# EAGLE design MainBoard (EAGLE 9.5.1)

## Sheet 1 of 5
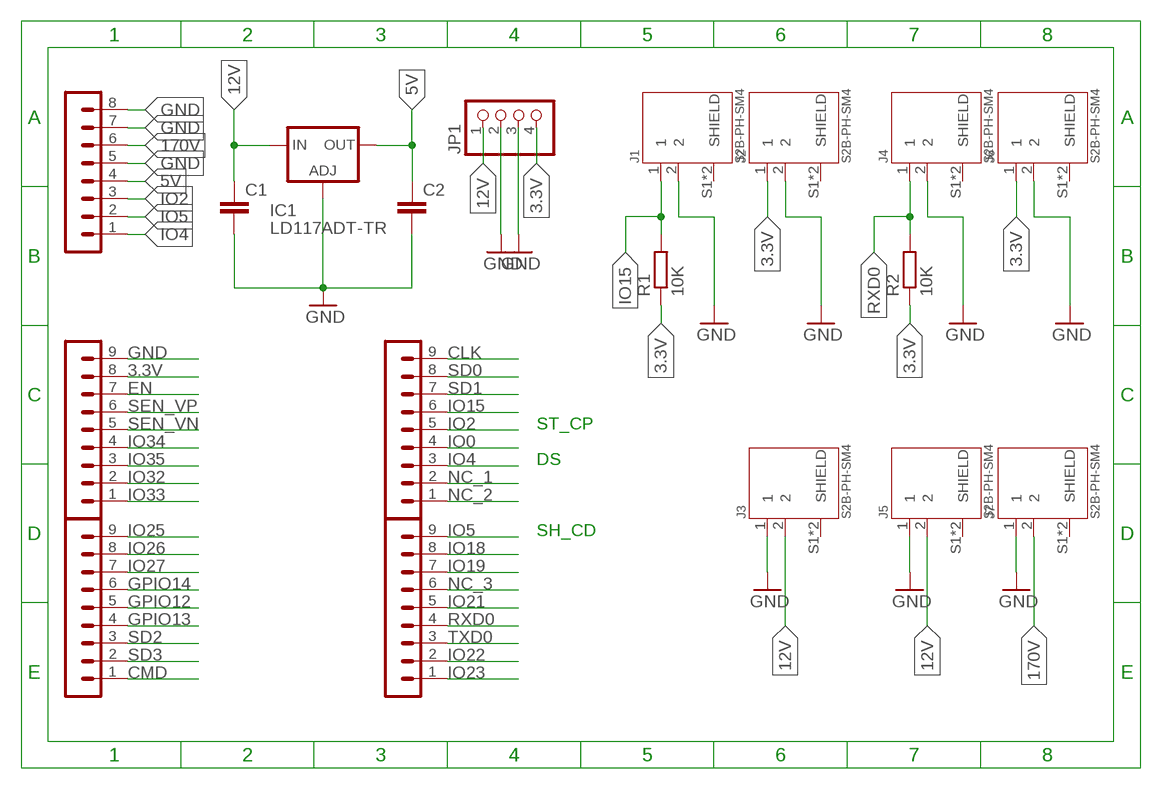
[diagram p0: schematic, sheet 1]

### Parts
C1  C-EU_1206C1206  [C1206]
C2  C-EU_1206C1206  [C1206]
IC1  LD117ADT-TR  [DPACK]
J1  S2B-PH-SM4  [JST_S2B-PH-SM4-TB(LF)(SN)]
J2  S2B-PH-SM4  [JST_S2B-PH-SM4-TB(LF)(SN)]
J3  S2B-PH-SM4  [JST_S2B-PH-SM4-TB(LF)(SN)]
J4  S2B-PH-SM4  [JST_S2B-PH-SM4-TB(LF)(SN)]
J5  S2B-PH-SM4  [JST_S2B-PH-SM4-TB(LF)(SN)]
J6  S2B-PH-SM4  [JST_S2B-PH-SM4-TB(LF)(SN)]
J7  S2B-PH-SM4  [JST_S2B-PH-SM4-TB(LF)(SN)]
JP1  PINHD-1X4  [1X04]
R1  10K  R-EU_1206R1206  [R1206]
R2  10K  R-EU_1206R1206  [R1206]
SV1  PINHEADER-1X8  [MA08-1]
SV2  PINHEADER-1X9  [MA09-1]
SV3  PINHEADER-1X9  [MA09-1]
SV4  PINHEADER-1X9  [MA09-1]
SV5  PINHEADER-1X9  [MA09-1]

### Nets
3.3V: J2.1 J6.1 JP1.4 R1.1 R2.1 SV2.8
5V: C2.1 IC1.4(OUT) SV1.4
12V: C1.1 IC1.3(IN) J3.2 J5.2 JP1.1
170V: J7.2 SV1.6
CLK: SV4.9
CMD: SV3.1
EN [other]: SV2.7
GND: C1.2 C2.2 IC1.1(ADJ) J1.2 J2.2 J3.1 J4.2 J5.1 J6.2 J7.1 JP1.2 JP1.3 SV1.5 SV1.7 SV1.8 SV2.9
GPIO12: SV3.5
GPIO13: SV3.4
GPIO14: SV3.6
IO0 [other]: SV4.4
IO2: SV1.3 SV4.5
IO4: SV1.1 SV4.3
IO5: SV1.2 SV5.9
IO15: J1.1 R1.2 SV4.6
IO18: SV5.8
IO19: SV5.7
IO21: SV5.5
IO22: SV5.2
IO23: SV5.1
IO25: SV3.9
IO26: SV3.8
IO27: SV3.7
IO32: SV2.2
IO33: SV2.1
IO34: SV2.4
IO35: SV2.3
NC_1: SV4.2
NC_2: SV4.1
NC_3: SV5.6
RXD0 [other]: J4.1 R2.2 SV5.4
SD0: SV4.8
SD1: SV4.7
SD2: SV3.3
SD3: SV3.2
SEN_VN: SV2.5
SEN_VP: SV2.6
TXD0 [other]: SV5.3
Unconnected: J1.S1(SHIELD) J1.S2(SHIELD) J2.S1(SHIELD) J2.S2(SHIELD) J3.S1(SHIELD) J3.S2(SHIELD) J4.S1(SHIELD) J4.S2(SHIELD) J5.S1(SHIELD) J5.S2(SHIELD) J6.S1(SHIELD) J6.S2(SHIELD) J7.S1(SHIELD) J7.S2(SHIELD)

### Notes on the sheet
- ST_CP
- DS
- SH_CD

## Sheet 2 of 5
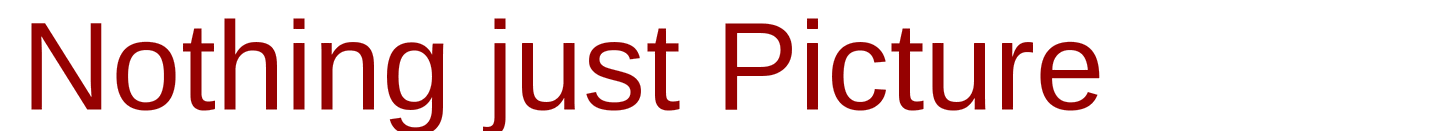
[diagram p1: schematic, sheet 2]

### Notes on the sheet
- Nothing just Picture

## Sheet 3 of 5

## Sheet 4 of 5
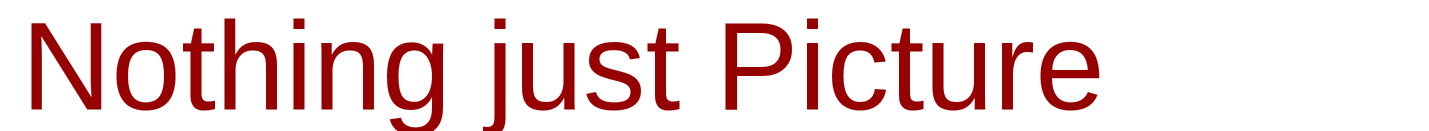
[diagram p2: schematic, sheet 4]

### Notes on the sheet
- Nothing just Picture

## Sheet 5 of 5

## Library data of the parts
C1 C2 = CommonParts:C-EU_1206: CAPACITOR, European symbol; SPICEPREFIX: C
IC1 = nixie_tube:LD117A?*: Low drop fixed and adjustable positive voltage regulators 1 A Source: http://www.st.com/stonline/products/literature/ds/7194/ld1117axx.pdf
J1-J7 = CommonParts:S2B-PH-SM4: PH Series 2 Position 2 mm Pitch Surface Mount Side Entry Shrouded Header; DESCRIPTION: PH Series 2 Position 2 mm Pitch Surface Mount Side Entry Shrouded Header; DIGI-KEY_PART_NUMBER: 455-1749-1-ND; DIGI-KEY_PURCHASE_URL: https://www.digikey.com/product-detail/en/jst-sales-america-inc/S2B-PH-SM4-TB_LF__SN_/455-1749-1-ND/926846?utm_source=snapeda&utm_medium=aggregator&utm_campaign=symbol; MF: JST Sales; MP: S2B-PH-SM4-TB_LF__SN_; PACKAGE: None
JP1 = pinhead:PINHD-1X4: PIN HEADER
R1 R2 = CommonParts:R-EU_1206: RESISTOR, European symbol
SV1 = CommonParts:PINHEADER-1X8: PIN HEADER; OC_FARNELL: unknown; OC_NEWARK: unknown
SV2-SV5 = CommonParts:PINHEADER-1X9: PIN HEADER; OC_FARNELL: unknown; OC_NEWARK: unknown

## Net classes
0 default: width 0.2 mm, drill 0.6 mm, clearance 0.2 mm
1 other: width 0.2 mm, drill 0.2 mm, clearance 0.1 mm

## Board
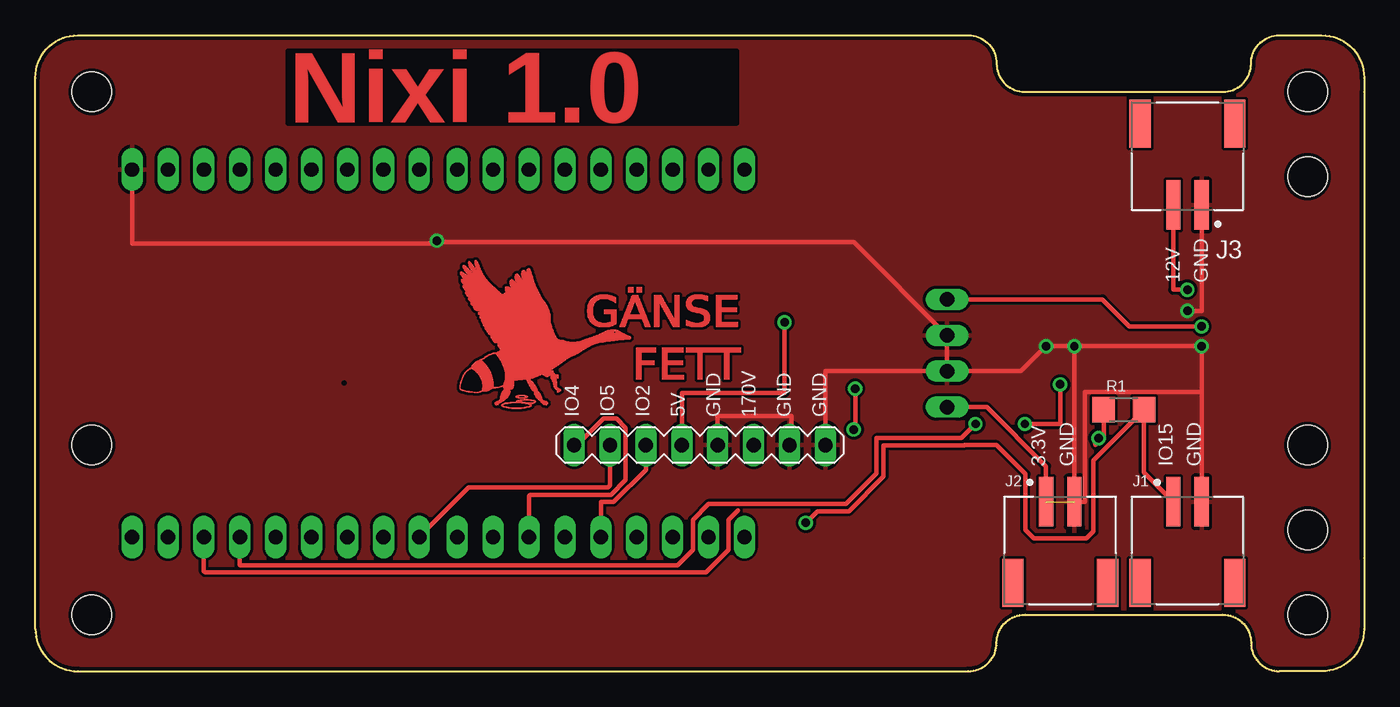
[diagram p3: board, top side]
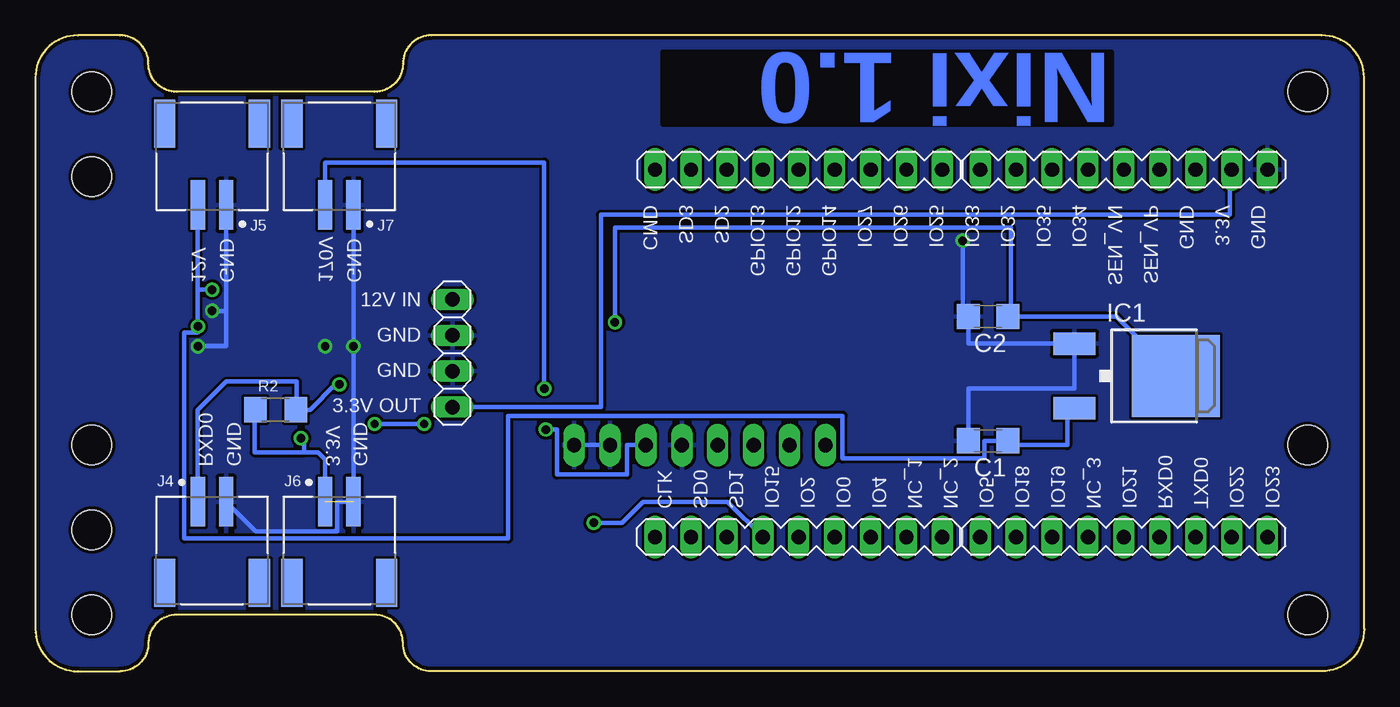
[diagram p4: board, bottom side, seen from below]

Size 94 x 45 mm. Coordinates in mm from the lower left corner, seen from the top.
Outline: 94,41 94,42 arc90 91,45 88,45 arc90 86,43 arc-90 84,41 70,41 arc-90 68,43 arc90 66,45 3,45 arc90 0,42 0,3 arc90 3,0 66,0 arc90 68,2 arc-90 70,4 84,4 arc-90 86,2 arc90 88,0 91,0 arc90 94,3 94,41
Outline: 94,41 94,8
Copper layers (1*16): Top 0.035mm / dielectric 1.5mm / Bottom 0.035mm
Design rules "Main_1": minimum track width 6mil, minimum drill 0.35mm, track to track 6mil, track to pad 6mil, pad to pad 6mil, via to via 6mil, smd to smd 6mil, copper to edge 10mil, drill to drill 6mil, minimum pad ring 10mil, minimum via ring 8mil, stop-mask expansion 4mil, vias tented up to drill 0mil, thermal gap 10mil
Holes 2.8 mm at 4,16 4,41 90,41 90,16 90,35 4,4 90,10 90,4
tKeepout: area 33.7,18.6 to 34.4,18.6; area 33.4,18.6 to 34.6,18.6; area 33.3,18.6 to 34.8,18.7; area 33.2,18.7 to 33.8,18.7; area 34.3,18.7 to 34.9,18.7; area 33.1,18.7 to 33.5,18.7; area 34.6,18.7 to 35,18.7; area 33.1,18.7 to 33.4,18.7; area 34.7,18.7 to 35,18.7; area 33,18.7 to 33.2,18.8; area 34.8,18.7 to 35.1,18.8; area 33,18.8 to 33.2,18.8; 2068 more areas

### Footprints (pad centres in the part's own frame; a part is rotated, then mirrored left to right if it is on the bottom)
C1206 = smd 1.6 x 1.8: 1 -1.4,0; 2 1.4,0
DPACK = smd 1.6 x 3: 1 -2.28,-4.8; 3 2.28,-4.8 | smd 5.8 x 6.2: 4 0,2.38
JST_S2B-PH-SM4-TB(LF)(SN) = smd 1 x 3.5: 1 -1,0; 2 1,0 | smd 1.5 x 3.4: S1 -3.35,-5.75; S2 3.35,-5.75
1X04 = drill 1.016 long: 1 -3.81,0; 2 -1.27,0; 3 1.27,0; 4 3.81,0
R1206 = smd 1.6 x 1.803: 1 -1.422,0; 2 1.422,0
MA08-1 = drill 1.016 long: 1 -8.89,0; 2 -6.35,0; 3 -3.81,0; 4 -1.27,0; 5 1.27,0; 6 3.81,0; 7 6.35,0; 8 8.89,0
MA09-1 = drill 1.016 long: 1 -10.16,0; 2 -7.62,0; 3 -5.08,0; 4 -2.54,0; 5 0,0; 6 2.54,0; 7 5.08,0; 8 7.62,0; 9 10.16,0

### Placement (x,y rotation side)
C1  26.6,16.3 180 bottom
C2  26.6,25.1 180 bottom
IC1  15.7,20.9 270 bottom
J1  81.5,12 0 top
J2  72.5,12 0 top
J3  81.5,33 180 top
J4  81.5,12 0 bottom
J5  81.5,33 180 bottom
J6  72.5,12 0 bottom
J7  72.5,33 180 bottom
JP1  64.5,22.5 270 bottom
R1  77,18.5 0 top
R2  77,18.5 0 bottom
SV1  47,16 0 top
SV2  17,35.5 0 bottom
SV3  40,35.5 0 bottom
SV4  40,9.5 180 bottom
SV5  17,9.5 180 bottom

### Tracks (layer width: path | path; a pad name or v marks a point on that pad's centre or on a via)
3.3V  (via drill 0.6)  (1 unrouted)
  Top 0.305: J2.1 71.5,14.5 67.31,18.69 JP1.4 | R1.1 75.58,16.58 75,16 75,16.29 v75.21,16.5
  Bottom 0.305: 75,15.5 74,15.5 73.5,15 J6.1 73.5,11.5 | 75,15.5 78.5,15.5 78.5,18.42 R2.1 | v75.21,16.5 75,16.29 75,15.5 | JP1.4 54,18.69 54,32.3 9.5,32.3 9.5,35.38 SV2.8
5V  (via drill 0.6)
  Top 0.305: SV1.4 45.73,19.7 53,19.7 v53,24.7
  Bottom 0.305: IC1.4 17.52,25.1 25,25.1 | 25,25.1 C2.1 | v53,24.7 53,31.4 25,31.4 25,25.1
12V  (via drill 0.6)
  Top 0.305: JP1.1 75.49,26.31 77.4,24.4 v82.5,24.4 | J3.2 80.5,27 v81.5,27
  Bottom 0.305: IC1.3 21,18.62 21,16 25.2,16 C1.1 26.85,16.3 26.85,15.05 36.89,15.05 36.89,18.08 60.54,18.08 60.54,9.39 83.46,9.39 83.46,23.96 82.5,23.96 v82.5,24.4 82.5,27 | 82.5,27 J5.2 | v81.5,27 82.5,27
170V  (via drill 0.6)
  Top 0.305: v57.9,17.11 58,17.11 v58,20
  Bottom 0.305: SV1.6 52.13,16 52.13,13.92 57.11,13.92 57.11,17.11 v57.9,17.11 | J7.2 73.5,36 58,36 v58,20
GND  (via drill 0.6)
  Top 0.305: JP1.3 69.73,21.23 v71.5,23 v73.5,23 | SV1.8 55.89,21.23 JP1.3 | SV2.9 6.84,30.27 28.4,30.27 v28.4,30.47 28.5,30.37 57.9,30.37 JP1.2 JP1.3 | J1.2 82.5,19.75 | 82.5,19.75 v82.5,23 v73.5,23 | v73.5,23 J2.2 74.25,12 74.25,19.75 82.5,19.75 | SV1.5 48.27,18.08 53.5,18.08 53.5,16 SV1.7 | J3.1 82.5,25.5 v81.5,25.5
  Bottom 0.305: C1.2 28,20 20.5,20 IC1.1 28,23.18 C2.2 28.4,25.5 v28.4,30.47 | SV1.8 SV1.7 | J4.2 78.4,9.9 72.65,9.9 72.65,12 J6.2 v71.5,23 J7.1 | J5.1 80.5,25.5 | 80.5,25.5 80.5,23 v82.5,23 | v81.5,25.5 80.5,25.5
  pour Top: 0,46 94,46 94,0 0,0
  pour Bottom: 0,46 94,46 94,0 0,0
IO2
  Top 0.305: SV1.3 43.19,14.26 40.92,11.99 40,11.99 SV4.5
IO4
  Top 0.305: SV1.1 38.31,16 40.19,17.88 41.11,17.88 41.76,17.22 41.76,13.55 40.71,12.49 35,12.49 34.92,12.41 SV4.3
IO5
  Top 0.305: SV5.9 30.66,13 40.5,13 40.65,13.15 SV1.2
IO15  (via drill 0.6)
  Top 0.2: 70.04,10 70,10.04
  Top 0.305: J1.1 78.42,14.08 R1.2 74.86,14.94 74.86,9.89 74.36,9.39 70.64,9.39 70.04,10 70.04,13.96 68,16 65.71,16 65.71,15.99 60.01,15.99 60.01,13.79 57.54,11.33 55.33,11.33 v54.5,10.5
  Bottom 0.305: SV4.6 45.03,12 51.01,12 52.5,10.5 v54.5,10.5
RXD0  (via drill 0.6)
  Top 0.305: v72.5,20.3 72.5,17.5 v70,17.5 | v66.5,17.5 65.5,16.5 59.5,16.5 59.5,14 57.33,11.83 47.62,11.83 46.51,10.72 46.51,8.59 45.42,7.5 14.5,7.5 14.46,7.54 SV5.4
  Bottom 0.305: J4.1 82.5,18.5 80.5,20.5 75.5,20.5 75.5,18.58 R2.2 74.58,18.5 72.78,20.3 v72.5,20.3 | v70,17.5 v66.5,17.5
TXD0
  Top 0.305: 49.7,11.38 49.05,10.72 49.05,8.59 47.46,7 12,7 11.92,7.08 SV5.3
(copper drawn outside any net)
  shapes: Top area x2081

### Text on the board
Top: Nixi 1.0
Bottom: Nixi 1.0
tNames: 12V | GND | IO4 | IO5 | IO2 | 5V | GND | 170V | GND | GND | 3.3V | GND | IO15 | GND
bNames: GND | 3.3V | GND | SEN_VP | SEN_VN | IO34 | IO35 | IO32 | IO33 | IO25 | IO26 | IO27 | GPIO14 | GPIO12 | GPIO13 | SD2 | SD3 | CMD | GND | 170V | GND | 12V | 12V IN | GND | GND | 3.3V OUT | GND | 3.3V | GND | RXD0 | IO23 | IO22 | TXD0 | RXD0 | IO21 | NC_3 | IO19 | IO18 | IO5 | NC_2 | NC_1 | IO4 | IO0 | IO2 | IO15 | SD1 | SD0 | CLK
tStop: Nixi 1.0
bStop: Nixi 1.0